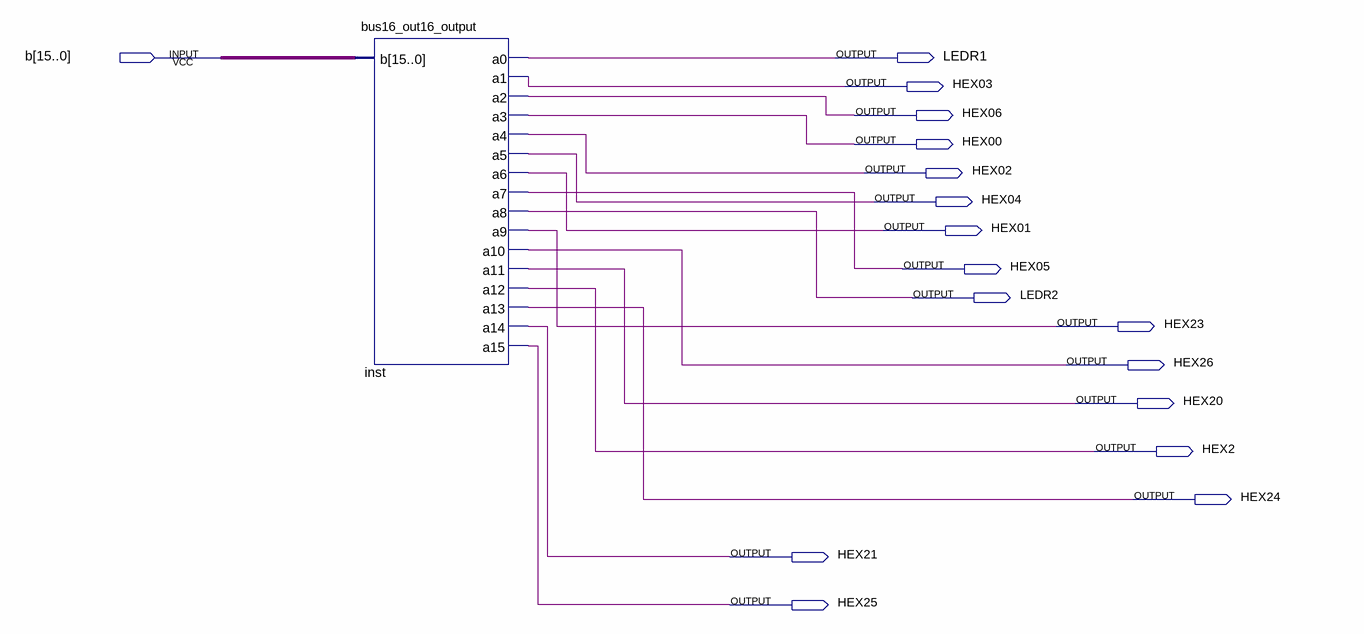
[diagram p0: schematic sheet]
// Quartus schematic b16_output.bdf as structural Verilog: 1 symbols, 17 pins
module b16_output (
  input  [15:0] b,
  output LEDR1,
  output HEX03,
  output HEX06,
  output HEX00,
  output HEX02,
  output HEX04,
  output HEX01,
  output HEX05,
  output LEDR2,
  output HEX23,
  output HEX26,
  output HEX20,
  output HEX2,
  output HEX24,
  output HEX21,
  output HEX25
);

  bus16_out16_output inst (
    .b(b), .a0(LEDR1), .a1(HEX03), .a2(HEX06), .a3(HEX00), .a4(HEX02), .a5(HEX04), .a6(HEX01), .a7(HEX05),
    .a8(LEDR2), .a9(HEX23), .a10(HEX26), .a11(HEX20), .a12(HEX2), .a13(HEX24), .a14(HEX21), .a15(HEX25));
endmodule
